# Altium project BC2087.PrjPcb (part 5 of 5)
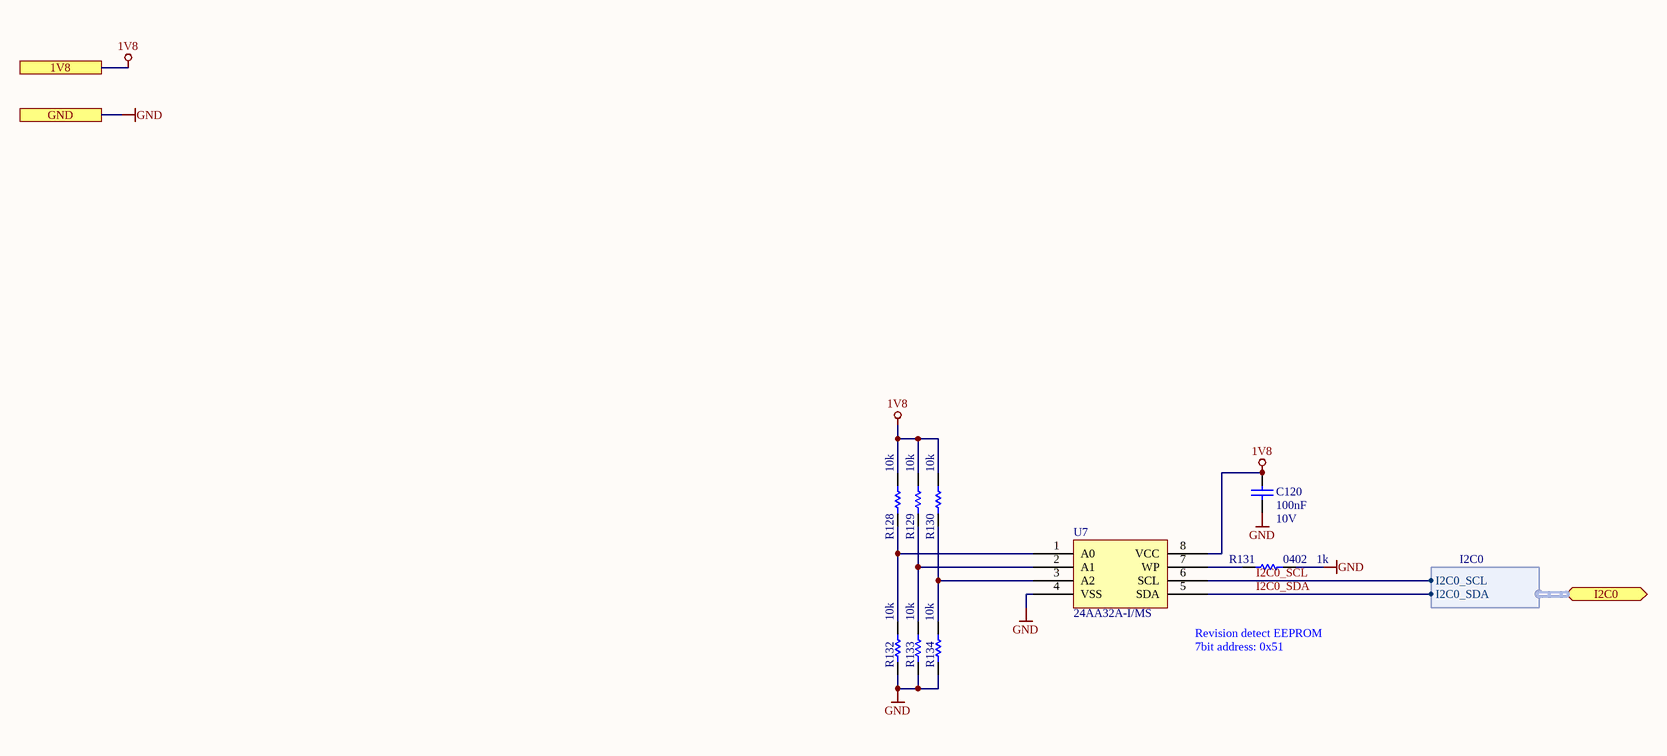
[diagram p15: EEPROM.SchDoc]

## Assembly variants
Production_MX: not fitted B1 J4 J5 J7 P1 R1 R2 R7 R22 R23 R35 R40 R47 R66 R67 R68 R80 R82 R129 R130 R132 SW2 U9
Production_KeemBay: not fitted B1 J4 J5 J7 P1 R1 R20 R21 R22 R23 R35 R40 R44 R45 R47 R66 R67 R68 R83 R129 R130 R132 SW2 U9